# EAGLE board MISSION_FM1 (EAGLE 5.10)
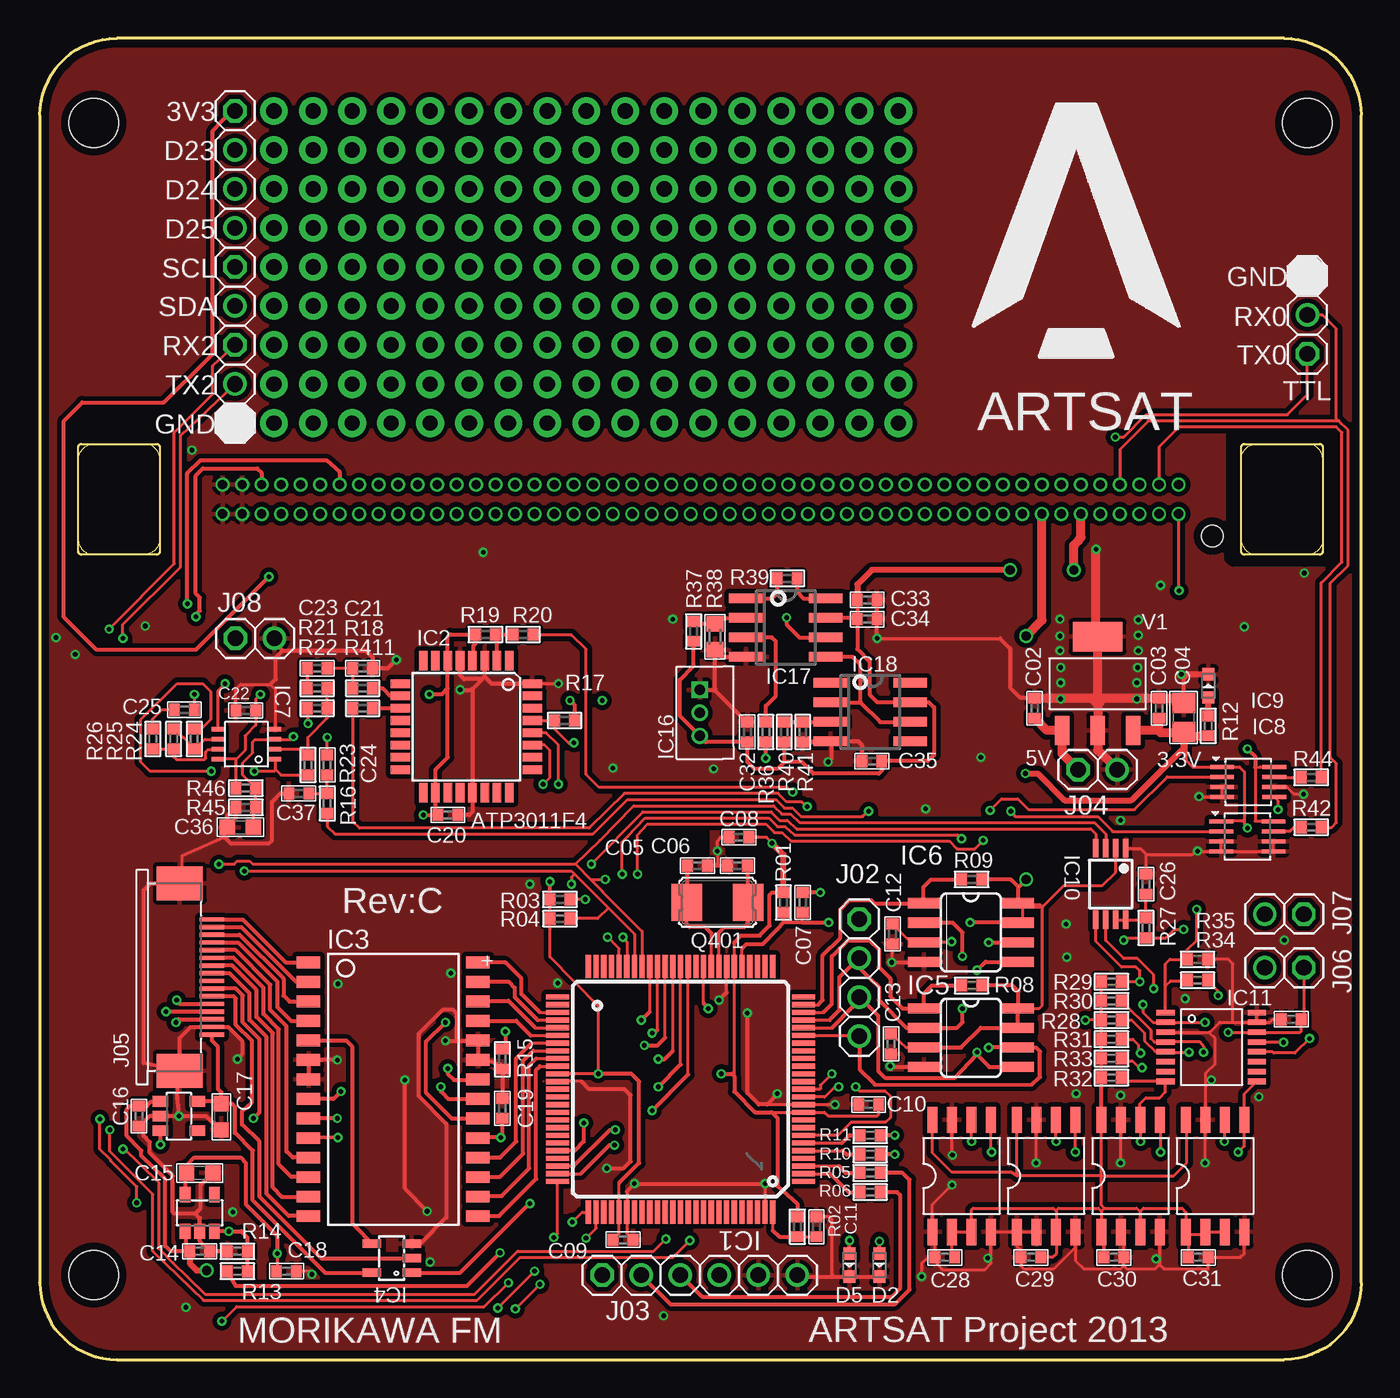
[diagram p2: board, top side]
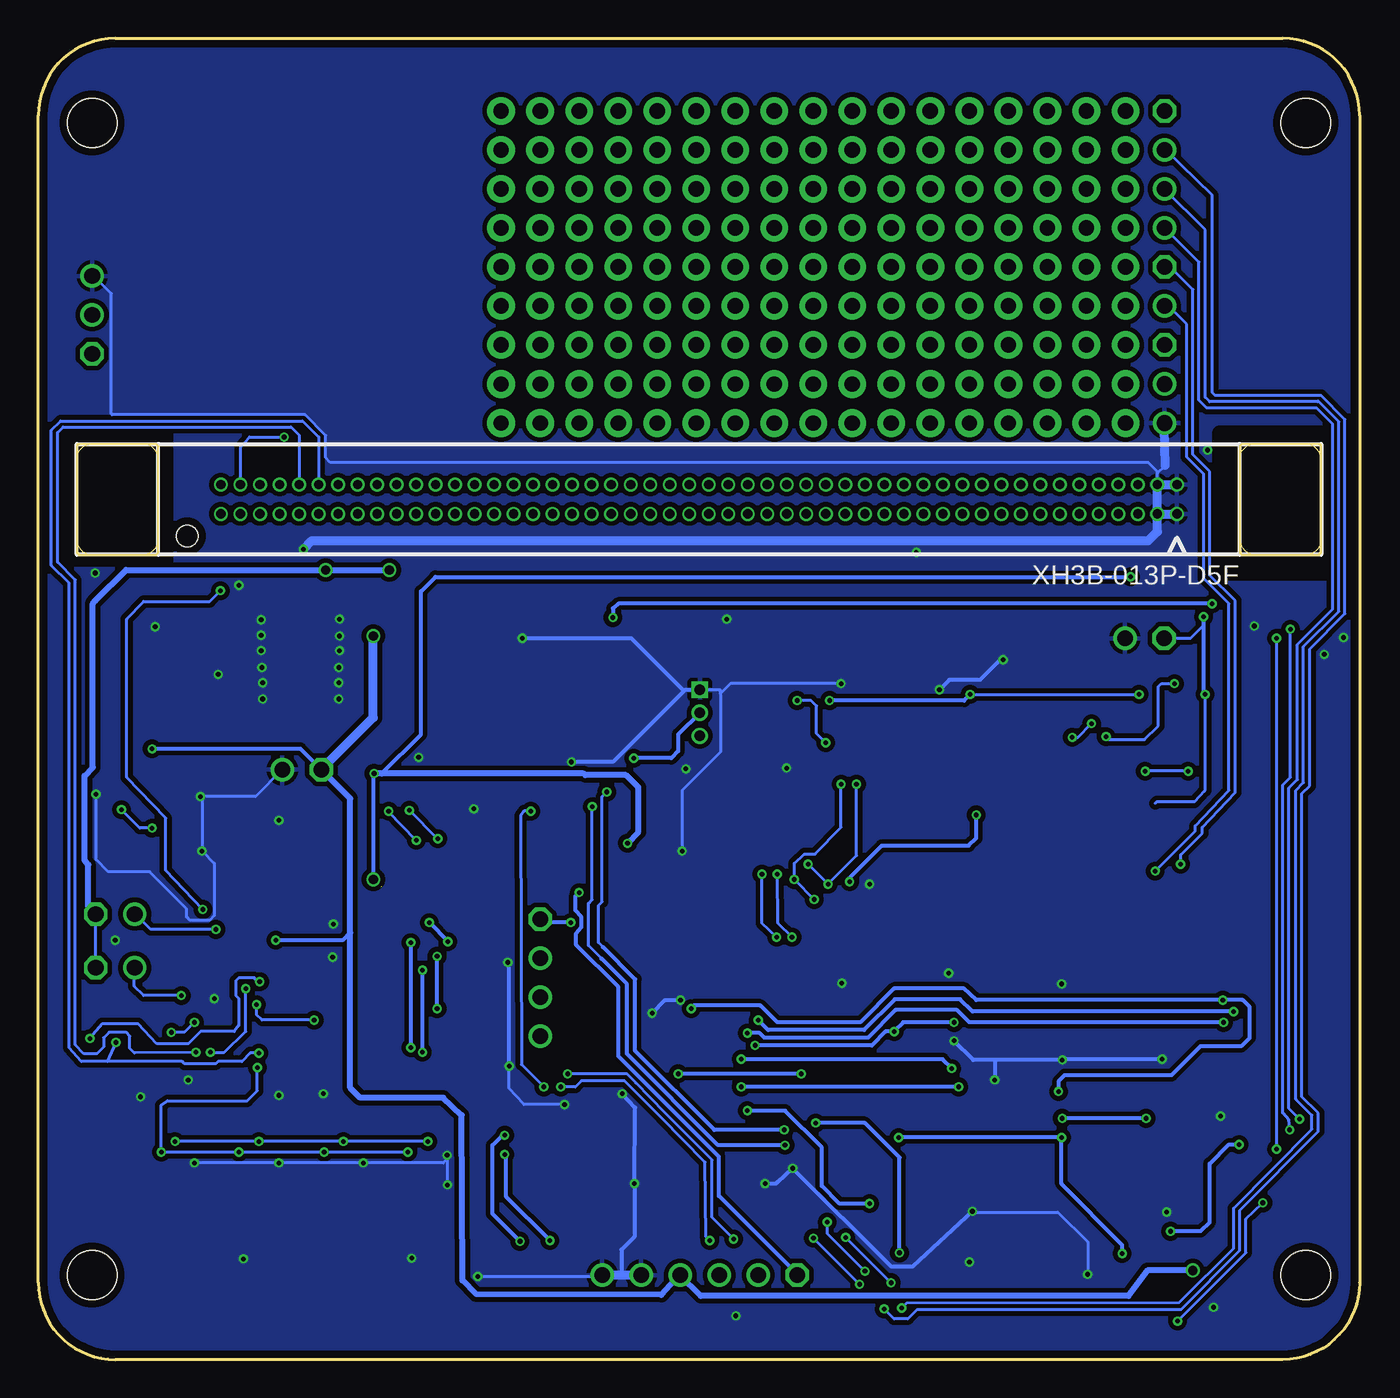
[diagram p3: board, bottom side, seen from below]

Size 86.1 x 86 mm. Coordinates in mm from the lower left corner, seen from the top.
Outline: 0.1,5 0.1,81 arc-90 5.1,86 81.1,86 arc-90 86.1,81 86.1,5 arc-90 81.1,0 5.1,0 arc-90 0.1,5
Outline: 0.1,5 0,5
Outline: 3.7,59.6 6.9,59.6 arc-90 7.9,58.6 7.9,53.4 arc-85 6.9,52.4 3.6,52.4 arc-90 2.6,53.4 2.6,58.6 arc-90 3.7,59.6
Outline: 3.7,59.6 3.6,59.6
Outline: 78.3,53.4 78.3,58.6 arc-90 79.3,59.6 82.6,59.6 arc-90 83.6,58.6 83.6,53.4 arc-90 82.6,52.4 79.3,52.4 arc-90 78.3,53.4
Copper layers (1*16): Top 0.035mm / dielectric 1.53mm / Bottom 0.035mm
Design rules "pban_5mil-l2": minimum track width 5mil, minimum drill 0.3mm, track to track 5mil, track to pad 0.229mm, pad to pad 5mil, via to via 5mil, smd to smd 5mil, copper to edge 0.5mm, drill to drill 0.5mm, minimum pad ring 0.15mm, minimum via ring 0.15mm, stop-mask expansion 4mil, vias tented up to drill 0.35mm, thermal gap 10mil
Holes 3.2 mm at 3.6,5.5 82.6,5.5 3.6,80.5 82.6,80.5
tRestrict: area 45.1,33 to 46.6,33.2; area 46.5,33 to 46.6,33; area 43.3,32.9 to 43.3,34.5; area 43.1,32.9 to 43.3,34.6; 7 lines
bRestrict: area 2.4,51.2 to 9.3,51.2; 10 lines

## Footprints (pad centres in the part's own frame; a part is rotated, then mirrored left to right if it is on the bottom)
C1015(0402) = smd 0.7 x 0.8: 1 -0.65,0; 2 0.65,0
C2012(0805) = smd 1.3 x 1.5: 1 -0.95,0; 2 0.95,0
C1608(0603) = smd 1 x 1: 1 -0.85,0; 2 0.85,0
LED1608 = smd 0.8 x 0.8: A -0.75,0; K 0.75,0
TQFP100 = smd 1.5 x 0.34: 1 -8,6; 2 -8,5.5; 3 -8,5; 4 -8,4.5; 5 -8,4; 6 -8,3.5; 7 -8,3; 8 -8,2.5; 9 -8,2; 10 -8,1.5; 11 -8,1; 12 -8,0.5; 13 -8,0; 14 -8,-0.5; 15 -8,-1; 16 -8,-1.5; 17 -8,-2; 18 -8,-2.5; 19 -8,-3; 20 -8,-3.5; 21 -8,-4; 22 -8,-4.5; 23 -8,-5; 24 -8,-5.5; 25 -8,-6; 51 8,-6; 52 8,-5.5; 53 8,-5; 54 8,-4.5; 55 8,-4; 56 8,-3.5; 57 8,-3; 58 8,-2.5; 59 8,-2; 60 8,-1.5; 61 8,-1; 62 8,-0.5; 63 8,0; 64 8,0.5; 65 8,1; 66 8,1.5; 67 8,2; 68 8,2.5; 69 8,3; 70 8,3.5; 71 8,4; 72 8,4.5; 73 8,5; 74 8,5.5; 75 8,6 | smd 0.34 x 1.5: 26 -6,-8; 27 -5.5,-8; 28 -5,-8; 29 -4.5,-8; 30 -4,-8; 31 -3.5,-8; 32 -3,-8; 33 -2.5,-8; 34 -2,-8; 35 -1.5,-8; 36 -1,-8; 37 -0.5,-8; 38 0,-8; 39 0.5,-8; 40 1,-8; 42 2,-8; 43 2.5,-8; 44 3,-8; 45 3.5,-8; 46 4,-8; 47 4.5,-8; 48 5,-8; 49 5.5,-8; 50 6,-8; 76 6,8; 77 5.5,8; 78 5,8; 79 4.5,8; 80 4,8; 81 3.5,8; 82 3,8; 83 2.5,8; 84 2,8; 85 1.5,8; 86 1,8; 87 0.5,8; 88 0,8; 89 -0.5,8; 90 -1,8; 91 -1.5,8; 92 -2,8; 93 -2.5,8; 95 -3.5,8; 97 -4.5,8; 99 -5.5,8; 100 -6,8 | smd 0.35 x 1.5: 41 1.5,-8 | smd 0.33 x 1.5: 94 -3,8; 96 -4,8; 98 -5,8
TQFP32-08 = smd 1.27 x 0.559: 1 -4.293,2.8; 2 -4.293,2; 3 -4.293,1.2; 4 -4.293,0.4; 5 -4.293,-0.4; 6 -4.293,-1.2; 7 -4.293,-2; 8 -4.293,-2.8; 17 4.293,-2.8; 18 4.293,-2; 19 4.293,-1.2; 20 4.293,-0.4; 21 4.293,0.4; 22 4.293,1.2; 23 4.293,2; 24 4.293,2.8 | smd 0.559 x 1.27: 9 -2.8,-4.293; 10 -2,-4.293; 11 -1.2,-4.293; 12 -0.4,-4.293; 13 0.4,-4.293; 14 1.2,-4.293; 15 2,-4.293; 16 2.8,-4.293; 25 2.8,4.293; 26 2,4.293; 27 1.2,4.293; 28 0.4,4.293; 29 -0.4,4.293; 30 -1.2,4.293; 31 -2,4.293; 32 -2.8,4.293
SOP28 = smd 0.762 x 1.524: 1 -8.255,-5.515; 2 -6.985,-5.515; 3 -5.715,-5.515; 4 -4.445,-5.515; 5 -3.175,-5.515; 6 -1.905,-5.515; 7 -0.635,-5.515; 8 0.635,-5.515; 9 1.905,-5.515; 10 3.175,-5.515; 11 4.445,-5.515; 12 5.715,-5.515; 13 6.985,-5.515; 14 8.255,-5.515; 15 8.255,5.515; 16 6.985,5.515; 17 5.715,5.515; 18 4.445,5.515; 19 3.175,5.515; 20 1.905,5.515; 21 0.635,5.515; 22 -0.635,5.515; 23 -1.905,5.515; 24 -3.175,5.515; 25 -4.445,5.515; 26 -5.715,5.515; 27 -6.985,5.515; 28 -8.255,5.515
SOT23-5@1 = smd 0.55 x 1.2: 1 -0.95,-1.3; 2 0,-1.3; 3 0.95,-1.3; 4 0.95,1.3; 5 -0.95,1.3
SO08 = smd 0.66 x 2.032: 1 -1.905,-3.073; 2 -0.635,-3.073; 3 0.635,-3.073; 4 1.905,-3.073; 5 1.905,3.073; 6 0.635,3.073; 7 -0.635,3.073; 8 -1.905,3.073
TVSP8 = smd 0.3 x 0.8: 1 -0.975,-1.866; 2 -0.325,-1.866; 3 0.325,-1.866; 4 0.975,-1.866; 5 0.975,1.866; 6 0.325,1.866; 7 -0.325,1.866; 8 -0.975,1.866
PSOP8 = smd 0.25 x 1.55: 1 -0.975,-1.7; 2 -0.325,-1.7; 3 0.325,-1.7; 4 0.975,-1.7; 5 0.975,1.7; 6 0.325,1.7; 7 -0.325,1.7; 8 -0.975,1.7
TSSOP8 = smd 1.2 x 0.35: 1 -2.325,0.975; 2 -2.325,0.325; 3 -2.325,-0.325; 4 -2.325,-0.975; 5 2.325,-0.975; 6 2.325,-0.325; 7 2.325,0.325; 8 2.325,0.975
TSSOP16 = smd 0.36 x 1.19: 1 -2.24,-3.03; 2 -1.6,-3.03; 3 -0.96,-3.03; 4 -0.32,-3.03; 5 0.32,-3.03; 6 0.96,-3.03; 7 1.6,-3.03; 8 2.24,-3.03; 9 2.24,2.91; 10 1.6,2.91; 11 0.96,2.91; 12 0.32,2.91; 13 -0.32,2.91; 14 -0.96,2.91; 15 -1.6,2.91; 16 -2.24,2.91
SOIC8 = smd 0.65 x 1.7: 1 -1.9,-3.65; 2 -0.63,-3.65; 3 0.64,-3.65; 4 1.91,-3.65; 5 1.91,3.65; 6 0.64,3.65; 7 -0.63,3.65; 8 -1.9,3.65
LM19_XH = drill 0.7 round: 1 -1.5,0; 2 0,0 | drill 0.7 square: 3 1.5,0
SO8 = smd 0.6 x 2.2: 1 -1.905,-2.6; 2 -0.635,-2.6; 3 0.635,-2.6; 4 1.905,-2.6; 5 1.905,2.6; 6 0.635,2.6; 7 -0.635,2.6; 8 -1.905,2.6
XH3B-013P-D5F = drill 0.6 pad 0.9 round: A1 -31.115,0.953; A2 -29.845,0.953; A3 -28.575,0.953; A4 -27.305,0.953; A5 -26.035,0.953; A6 -24.765,0.953; A7 -23.495,0.953; A8 -22.225,0.953; A9 -20.955,0.953; A10 -19.685,0.953; A11 -18.415,0.953; A12 -17.145,0.953; A13 -15.875,0.953; A14 -14.605,0.953; A15 -13.335,0.953; A16 -12.065,0.953; A17 -10.795,0.953; A18 -9.525,0.953; A19 -8.255,0.953; A20 -6.985,0.953; A21 -5.715,0.953; A22 -4.445,0.953; A23 -3.175,0.953; A24 -1.905,0.953; A25 -0.635,0.953; A26 0.635,0.953; A27 1.905,0.953; A28 3.175,0.953; A29 4.445,0.953; A30 5.715,0.953; A31 6.985,0.953; A32 8.255,0.953; A33 9.525,0.953; A34 10.795,0.953; A35 12.065,0.953; A36 13.335,0.953; A37 14.605,0.953; A38 15.875,0.953; A39 17.145,0.953; A40 18.415,0.953; A41 19.685,0.953; A42 20.955,0.953; A43 22.225,0.953; A44 23.495,0.953; A45 24.765,0.953; A46 26.035,0.953; A47 27.305,0.953; A48 28.575,0.953; A49 29.845,0.953; A50 31.115,0.953; B1 -31.115,-0.953; B2 -29.845,-0.953; B3 -28.575,-0.953; B4 -27.305,-0.953; B5 -26.035,-0.953; B6 -24.765,-0.953; B7 -23.495,-0.953; B8 -22.225,-0.953; B9 -20.955,-0.953; B10 -19.685,-0.953; B11 -18.415,-0.953; B12 -17.145,-0.953; B13 -15.875,-0.953; B14 -14.605,-0.953; B15 -13.335,-0.953; B16 -12.065,-0.953; B17 -10.795,-0.953; B18 -9.525,-0.953; B19 -8.255,-0.953; B20 -6.985,-0.953; B21 -5.715,-0.953; B22 -4.445,-0.953; B23 -3.175,-0.953; B24 -1.905,-0.953; B25 -0.635,-0.953; B26 0.635,-0.953; B27 1.905,-0.953; B28 3.175,-0.953; B29 4.445,-0.953; B30 5.715,-0.953; B31 6.985,-0.953; B32 8.255,-0.953; B33 9.525,-0.953; B34 10.795,-0.953; B35 12.065,-0.953; B36 13.335,-0.953; B37 14.605,-0.953; B38 15.875,-0.953; B39 17.145,-0.953; B40 18.415,-0.953; B41 19.685,-0.953; B42 20.955,-0.953; B43 22.225,-0.953; B44 23.495,-0.953; B45 24.765,-0.953; B46 26.035,-0.953; B47 27.305,-0.953; B48 28.575,-0.953; B49 29.845,-0.953; B50 31.115,-0.953 | hole 1.4: 33.315,2.4
1X04 = drill 1.016 octagon: 1 -3.81,0 | drill 1.016 round: 2 -1.27,0; 3 1.27,0; 4 3.81,0
1X06 = drill 1.016 octagon: 1 -6.35,0 | drill 1.016 round: 2 -3.81,0; 3 -1.27,0; 4 1.27,0; 5 3.81,0; 6 6.35,0
1X02 = drill 1.016 octagon: 1 -1.27,0 | drill 1.016 round: 2 1.27,0
MOREX_527461671 = smd 0.28 x 1.6: 1 -3.75,0; 2 -3.25,0; 3 -2.75,0; 4 -2.25,0; 5 -1.75,0; 6 -1.25,0; 7 -0.75,0; 8 -0.25,0; 9 0.25,0; 10 0.75,0; 11 1.25,0; 12 1.75,0; 13 2.25,0; 14 2.75,0; 15 3.25,0; 16 3.75,0 | smd 2.2 x 3: P1 -6.1,2.1; P2 6.1,2.1
1X03 = drill 1.016 octagon: 1 -2.54,0 | drill 1.016 round: 2 0,0; 3 2.54,0
NX5032GA = smd 2 x 2.4: 1 -2,0; 2 2,0
R1005M(0603) = smd 0.7 x 0.8: 1 -0.65,0; 2 0.65,0
R1608M(0603) = smd 1 x 1.1: 1 -0.85,0; 2 0.85,0
SOT-223 = smd 0.95 x 1.9: 1 -2.3,-3.05; 2 0,-3.05; 3 2.3,-3.05 | smd 3.25 x 1.9: 4 0,3.05
SOT-25 = smd 0.7 x 1: 1 -0.95,-1.2; 2 0,-1.2; 3 0.95,-1.2; 4 0.95,1.2; 5 -0.95,1.2

## Placement (x,y rotation side)
C02  0.1u  [C1015(0402)]  64.85,42.4 90 top
C03  0.1u  [C1015(0402)]  72.95,42.4 90 top
C04  10u  [C2012(0805)]  74.55,41.8 90 top
C05  15p  [C1015(0402)]  42.9,32.15 180 top
C06  15p  [C1015(0402)]  45.5,32.15 0 top
C07  0.1u  [C1015(0402)]  49.75,29.75 270 top
C08  0.1u  [C1015(0402)]  45.6,34 180 top
C09  0.1u  [C1015(0402)]  38.05,7.8 0 top
C10  0.1u  [C1015(0402)]  54.05,16.6 180 top
C11  0.1u  [C1015(0402)]  50.65,8.65 90 top
C12  0.1u  [C1015(0402)]  55.6,27.7 270 top
C13  0.1u  [C1015(0402)]  55.5,20.55 270 top
C14  0.1u  [C1015(0402)]  10.5,7.05 0 top
C15  10uF  [C1608(0603)]  10.5,12.15 0 top
C16  0.1u  [C1015(0402)]  6.55,15.85 270 top
C17  10uF  [C1608(0603)]  11.9,15.8 270 top
C18  0.1u  [C1015(0402)]  16.15,5.75 0 top
C19  0.1u  [C1015(0402)]  30.2,16.35 90 top
C20  0.1u  [C1015(0402)]  26.65,35.45 0 top
C21  4.7u  [C1015(0402)]  21.1,45 0 top
C22  0.1u  [C1015(0402)]  13.5,42.25 180 top
C23  0.1u  [C1015(0402)]  18.15,45 180 top
C24  0.1u  [C1015(0402)]  18.8,38.7 90 top
C25  0.1u  [C1015(0402)]  9.5,42.3 180 top
C26  0.1u  [C1015(0402)]  72.1,30.95 90 top
C27  0.1u  [C1015(0402)]  81.55,22.15 180 top
C28  0.1u  [C1015(0402)]  59,6.65 180 top
C29  0.1u  [C1015(0402)]  64.6,6.65 180 top
C30  0.1u  [C1015(0402)]  70,6.65 0 top
C31  0.1u  [C1015(0402)]  75.5,6.65 0 top
C32  0.1u  [C1015(0402)]  46.15,40.85 90 top
C33  0.1u  [C1015(0402)]  53.95,49.45 0 top
C34  0.1u  [C1015(0402)]  53.95,48.2 0 top
C35  0.1u  [C1015(0402)]  54.25,38.95 180 top
C36  10uF  [C1608(0603)]  13.15,34.65 180 top
C37  4.7u  [C1015(0402)]  16.95,36.85 180 top
D1  LED1608  [LED1608]  52.8,6.15 270 top
D2  LED1608  [LED1608]  54.75,6.15 270 top
D401  LED1608  [LED1608]  76.15,43.85 90 top
IC1  ATMEGA2560  [TQFP100]  41.8,17.6 180 top
IC2  APT3011F4-AU  [TQFP32-08]  27.85,41.2 270 top
IC3  AL422B  [SOP28]  23.1,17.6 270 top
IC4  SN74LVC1G00DVBR  [SOT23-5@1]  23,6.6 90 top
IC5  FM25V10  [SO08]  60.7,20.95 270 top
IC6  M25P80  [SO08]  60.7,27.8 270 top
IC7  NJM8202  [TVSP8]  13.55,40.05 90 top
IC8  SN74LVC2T45  [PSOP8]  78.7,34.05 270 top
IC9  SN74LVC2T45  [PSOP8]  78.75,37.6 270 top
IC10  PCA9306DP1  [TSSOP8]  69.8,30.95 270 top
IC11  ADG709  [TSSOP16]  76.4,20.35 270 top
IC12  24LC1025-I/SM  [SOIC8]  65.6,11.95 0 top
IC13  24LC1025-I/SM  [SOIC8]  71.1,11.95 0 top
IC14  24LC1025-I/SM  [SOIC8]  76.6,11.95 0 top
IC15  24LC1025-I/SM  [SOIC8]  60.1,11.95 0 top
IC16  LM19_ZH  [LM19_XH]  43.05,42.1 90 top
IC17  AD623R  [SO8]  48.65,47.65 270 top
IC18  AD8541R  [SO8]  54.15,42.15 270 top
J01  XH3B-013P-D5F_NEW  [XH3B-013P-D5F]  43.1,56 180 bottom
J02  [1X04]  53.44,24.86 270 top
J03  [1X06]  43.05,5.5 0 top
J04  [1X02]  68.95,38.4 0 top
J05  FFCMOREX_527461671  [MOREX_527461671]  11.3,24.9 90 top
J06  [1X02]  81.1,25.5 180 top
J07  [1X02]  81.1,29 180 top
J08  [1X02]  14.1,46.95 0 top
J09  [1X03]  82.6,68 90 top
J10  [1X04]  12.8,77.47 270 top
J11  [1X02]  12.8,69.85 270 top
J12  [1X03]  12.8,63.5 270 top
Q401  NX5032GA  [NX5032GA]  44.2,29.75 180 top
R01  10k  [R1005M(0603)]  48.5,29.75 90 top
R02  0  [R1005M(0603)]  49.4,8.65 270 top
R03  4.7k  [R1005M(0603)]  33.95,29.95 180 top
R04  4.7k  [R1005M(0603)]  33.95,28.7 180 top
R05  100  [R1005M(0603)]  54.15,12.15 180 top
R06  100  [R1005M(0603)]  54.15,10.9 180 top
R08  100k  [R1005M(0603)]  60.75,24.35 0 top
R09  100k  [R1005M(0603)]  60.75,31.25 0 top
R10  10k  [R1005M(0603)]  54.15,13.35 180 top
R11  10k  [R1005M(0603)]  54.15,14.6 180 top
R12  1k  [R1005M(0603)]  76.15,41.25 90 top
R13  1k  [R1005M(0603)]  12.95,5.75 0 top
R14  10k  [R1005M(0603)]  12.95,7.05 0 top
R15  1k  [R1005M(0603)]  30.2,19.55 90 top
R16  4.7k  [R1005M(0603)]  18.8,36.2 90 top
R17  10k  [R1005M(0603)]  34.25,41.6 180 top
R18  4.7k  [R1005M(0603)]  21.1,43.7 180 top
R19  10k  [R1005M(0603)]  29.1,47.2 180 top
R20  1k  [R1005M(0603)]  31.55,47.2 180 top
R21  6.8k  [R1005M(0603)]  18.15,43.7 0 top
R22  20k  [R1005M(0603)]  18.15,42.4 0 top
R23  20k  [R1005M(0603)]  17.55,38.7 270 top
R24  20k  [R1005M(0603)]  10.15,40.4 270 top
R25  200k  [R1005M(0603)]  8.8,40.4 270 top
R26  51  [R1005M(0603)]  7.45,40.4 90 top
R27  200k  [R1005M(0603)]  72.1,28.1 270 top
R28  2k  [R1005M(0603)]  69.85,22.1 180 top
R29  2k  [R1005M(0603)]  69.85,24.6 180 top
R30  2k  [R1005M(0603)]  69.85,23.35 180 top
R31  2k  [R1005M(0603)]  69.85,20.85 180 top
R32  2k  [R1005M(0603)]  69.85,18.35 180 top
R33  2k  [R1005M(0603)]  69.85,19.6 180 top
R34  1k  [R1005M(0603)]  75.45,24.7 0 top
R35  10k  [R1005M(0603)]  75.45,26.05 180 top
R36  820  [R1005M(0603)]  47.35,40.85 90 top
R37  2k  [R1005M(0603)]  42.65,47.4 90 top
R38  1k  [R1608M(0603)]  44.05,47.05 90 top
R39  33k  [R1005M(0603)]  48.75,50.85 180 top
R40  10k  [R1005M(0603)]  48.55,40.85 270 top
R41  10k  [R1005M(0603)]  49.75,40.85 90 top
R42  100  [R1005M(0603)]  82.85,34.65 180 top
R44  100  [R1005M(0603)]  82.85,37.9 0 top
R45  4.7k  [R1005M(0603)]  13.5,35.95 0 top
R46  4.7k  [R1005M(0603)]  13.5,37.2 180 top
R411  1k  [R1005M(0603)]  21.1,42.4 0 top
U$1  [ARTSAT_LOGO_16MM]  60.1,64 0 top
V1  TC1262-VDB  [SOT-223]  68.95,44 0 top
V2  XC6209F332MR  [SOT-25]  10.5,9.55 0 top
V3  XC6221A282MR  [SOT-25]  9.15,15.85 270 top

## Tracks (layer width: path | path; a pad name or v marks a point on that pad's centre or on a via)
AOUT  (via drill 0.3)
  Top 0.2: 10.2,42.25 C25.1 10.2,42.35 10.1,42.45 10.15,42.45 v10.15,43.3
  Top 0.25: J01.B3 14.53,57.73 14.25,58 10.7,58 10.25,57.55 10.25,49.85 10.5,49.6 10.5,48.75 10.25,48.5 v10.25,48.35 | v10.15,43.3 10.25,43.4
  Bottom 0.2: 13.4,36.2 13.3,36.3 10.85,36.3 10.2,37 10.15,37.05 v10.15,43.3 | J08.1 11.1,46.95 10.25,47.8
  Bottom 0.25: v10.25,48.35 10.25,47.8 10.25,43.4 v10.15,43.3
BBBB
  Top 0.25: R05.1 56.25,12.15 56.7,11.7 56.7,4.55 55.75,3.6 41.14,3.6 J03.2
BBBBB
  Top 0.25: J03.3 41.8,5.5 43.2,4.1 55.55,4.1 56.1,4.65 56.1,10.7 55.9,10.9 R06.1
BUS_SCL  (via drill 0.3)
  Top 0.2: 70.7,23.35 R30.1 72.4,21.45 72.4,20.9 72.63,20.67 IC11.4 73.35,20.7 75.6,20.7 75.85,20.4 v75.85,20
  Bottom 0.2: v75.85,20 79.85,19.95 80.15,20.25 80.15,21.05 80.4,21.3 81.5,21.3 81.85,20.95 81.85,20.35 82.3,19.9 83.15,19.9 83.7,20.5 83.7,50.75 84.85,51.9 84.85,60.35 84.5,60.7 69.65,60.7 69.13,60.19 J01.B46
BUS_SDA  (via drill 0.3)
  Top 0.2: R31.1 71.25,20.85 71.6,20.5 71.6,20.1 v71.75,19.95 | v81.05,20.65 79.33,20.65 IC11.13
  Bottom 0.2: v71.75,19.95 72.3,19.95 72.85,19.4 74.4,19.4 74.55,19.25 76.6,19.25 76.75,19.4 81.6,19.4 | 81.6,19.4 83.3,19.4 84.1,20.3 84.1,50.55 85.25,51.7 85.25,60.5 84.65,61.1 68.9,61.1 67.85,60.05 67.85,56.97 J01.B45 | 81.6,19.4 v81.05,20.65
C4022
  Top 0.2: IC1.33 44.3,27.8
  Top 0.25: 44.3,27.8 44.65,28.15 45.95,28.15 46.15,28.35 46.15,28.4 46.2,28.45 Q401.1 46.2,32.1 C06.2
CAM_PWR  (via drill 0.3)
  Top 0.2: 34.9,13.6 IC1.71
  Top 0.25: 34.9,13.6 35.5,14.2 v35.5,15.4 | v30.05,6.95 27.9,4.8 12.85,4.8 R13.1
  Bottom 0.25: v35.5,15.4 32.3,15.4 30.05,13.15 v30.05,6.95
D0
  Top 0.25: IC3.1 16.09,25.86 13.3,28.65 J05.16
D1
  Top 0.25: J05.15 13.2,28.15 16.75,24.6 17.47,24.6 IC3.2
D2
  Top 0.25: J05.14 13.1,27.65 15.95,24.8 15.95,23.7 16.35,23.3 17.47,23.3 IC3.3
D3
  Top 0.25: IC3.4 16.46,22.05 15.55,22.95 15.55,24.6 13,27.15 J05.13
D4
  Top 0.25: J05.12 12.85,26.65 15.1,24.4 15.1,22.75 16.15,21.7 16.15,13.55 16.55,13.15 17.48,13.15 IC3.11
D5
  Top 0.25: IC3.12 16.46,11.88 15.65,12.7 15.65,21.5 14.65,22.5 14.65,24.2 12.7,26.15 J05.11
D6
  Top 0.25: J05.10 12.6,25.65 14.2,24.05 14.2,22.3 15.25,21.25 15.25,11.2 15.85,10.6 17.47,10.6 IC3.13
D7
  Top 0.25: J05.9 12.45,25.15 13.75,23.85 13.75,22.1 14.85,21 14.85,10.8 16.3,9.35 17.48,9.35 IC3.14
D23  (via drill 0.3)
  Top 0.2: v31.05,3.3 v32.65,4.9 | v35.65,7.9 36.3,8.55 IC1.77
  Bottom 0.2: J10.2 12.74,78.74 9.7,75.8 9.7,62.95 9.5,62.75 2.6,62.75 1.05,61.2 1.05,48.55 3.35,46.25 3.35,37.35 3.85,36.85 3.85,17.1 2.8,16.05 2.8,14.85 7.9,9.7 7.9,7.1 11.75,3.25 28.9,3.25 29.5,2.65 30.4,2.65 v31.05,3.3 | v32.65,4.9 v35.65,7.9
D24  (via drill 0.3)
  Top 0.2: IC1.76 35.4,9.6 v34.75,8.95 | v29.9,3.35 v32.3,5.75
  Bottom 0.2: v34.75,8.95 34.75,8.2 v32.3,5.75 | v29.9,3.35 29.6,3.65 11.85,3.7 8.3,7.25 8.3,9.85 3.2,15 3.2,15.9 4.25,16.95 4.25,37.05 3.75,37.55 3.75,46.4 1.45,48.7 1.45,61.05 2.8,62.4 2.85,62.35 9.85,62.35 10.15,62.65 10.15,73.54 J10.3
D25  (via drill 0.3)
  Top 0.2: IC1.75 33.8,8.2 v33.55,7.95 | v30.6,5 29,3.45 12.9,3.45 v11.95,2.5 | v4,15.65 4,13.7 4.7,13 4.75,12.9 6.4,11.25 v6.4,10.2
  Bottom 0.2: v30.6,5 v33.55,7.95 | v4,15.65 4.7,16.35 4.7,37.2 4.15,37.75 4.15,46.55 1.85,48.85 1.85,60.9 2.9,61.95 10.05,61.95 10.55,62.45 10.55,71.44 12.77,73.66 J10.4 | v11.95,2.5 7.5,6.95 7.5,9.15 v6.4,10.2
DIGI_OUT
  Top 0.2: C23.1 C21.1 R18.2
DIGI_PLAY  (via drill 0.3)
  Top 0.2: IC1.74 35.3,12.1 | R411.1 20.5,42.35 20.5,35 20.9,34.6 35.85,34.6 38.15,36.85 48.15,36.85 48.7,36.3 49.7,36.3 v50.05,36
  Top 0.25: 35.3,12.1 37.15,13.95 v37.5,13.95
  Bottom 0.2: 47.8,24.45 50.3,26.95 50.3,29.7 50.05,29.95 v50.05,36
  Bottom 0.25: v37.5,13.95 41.85,13.95 47.8,19.9 47.8,24.45 49.45,26.1
DIGI_SLEEP  (via drill 0.3)
  Top 0.2: IC1.73 34.85,12.6 | R20.1 32.25,47.15 34.7,47.15 35.65,46.25 35.65,38.1 36.5,37.25 48.75,37.25 v49.1,36.95
  Top 0.25: 34.85,12.6 37.2,14.95 v37.55,14.95
  Bottom 0.2: 49.35,26.85 49.65,27.15 49.65,29.55 49.4,29.8 49.4,36.65 v49.1,36.95
  Bottom 0.25: v37.55,14.95 42.1,14.95 47.25,20.1 47.25,24.75 49.35,26.85
DO0
  Top 0.2: 32.65,22.6 IC1.53
  Top 0.25: 32.65,22.6 31.45,23.8 31.45,24.8 30.4,25.85 IC3.28
DO1
  Top 0.2: 32.5,22.1 IC1.54
  Top 0.25: 32.5,22.1 31,23.6 31,24.2 30.6,24.6 IC3.27
DO2
  Top 0.2: 32.35,21.6 IC1.55
  Top 0.25: 32.35,21.6 30.6,23.35 28.65,23.35 IC3.26
DO3
  Top 0.2: 32.05,21.1 IC1.56
  Top 0.25: 32.05,21.1 31.1,22.05 IC3.25
DO4
  Top 0.2: 32.1,20.6 IC1.57
  Top 0.25: IC3.18 30.05,13.15 31.1,14.2 31.1,19.6 32.1,20.6
DO5
  Top 0.2: 32.2,20.1 IC1.58
  Top 0.25: 32.2,20.1 31.55,19.45 31.55,13.4 30.05,11.9 IC3.17
DO6
  Top 0.2: 32.4,19.6 IC1.59
  Top 0.25: 32.4,19.6 31.95,19.15 31.95,12.45 30.15,10.65 28.65,10.65 IC3.16
DO7
  Top 0.2: 32.65,19.1 IC1.60
  Top 0.25: IC3.15 30,9.35 32.4,11.75 32.4,18.85 32.65,19.1
F  (via drill 0.3)
  Top 0.2: R28.1 71.15,22.1 72,21.25 72,20.75 72.7,20.05 73.35,20.05 IC11.5 73.4,20 v74.9,20 | IC10.6 69.47,27.27 70.65,26.1 71.55,26.1 72.6,25.05 v72.6,24.15
  Bottom 0.2: v72.6,24.15 72.6,21.35 74,20 v74.9,20
FLASH_CS
  Top 0.2: IC1.24 50.75,23.1
  Top 0.25: 50.75,23.1 51.05,23.4 51.05,26.3 52.2,27.45 52.2,29.3 52.8,29.91 54.2,29.91 54.4,29.7 IC6.1 57.6,29.73 57.6,30.75 58.1,31.25 R09.1
FRAM_CS
  Top 0.2: IC1.23 51.1,22.6
  Top 0.25: 51.1,22.6 51.65,23.15 51.65,26.25 52.7,27.3 54.1,27.3 54.7,26.7 54.7,25.55 55.45,24.8 55.45,23.65 56.25,22.85 56.5,22.86 IC5.1 57.65,22.88 57.65,23.85 58.15,24.35 R08.1
GND  (via drill 0.3)
  Top 0.2: 38.3,10.95 IC1.81 38.3,8.2 C09.2 | v47.3,11.45 IC1.99 | 44.8,23.9 IC1.32 | 47.45,16.6 IC1.11 v51.85,16.6 | 35.35,18.1 IC1.62 | IC11.15 IC11.16 | IC11.15 80.15,21.95 80.35,22.15 C27.2 | IC11.3 76.26,21.31 76.9,21.95 77.75,21.95 | 77.75,21.95 IC11.15 | IC12.1 63.7,7.35 63.95,7.1 C29.2 63.95,6.1 64.15,5.9 66.1,5.9 67.51,7.31 IC12.4 67.51,6.44 68.05,5.9 70.45,5.9 70.65,6.1 | IC13.2 70.65,8.12 C30.2 70.65,6.1 | IC14.4 78.5,6.9 78.25,6.65 C31.2 76.15,5.9 73.25,5.9 73,6.15 IC13.4 73.01,6.21 72.7,5.9 70.85,5.9 70.65,6.1 | IC12.1 IC15.4 62.01,6.26 61.6,5.85 58.85,5.85 58.25,6.6 | IC12.1 IC12.2 | 58.25,6.6 C28.2 58.35,8.15 IC15.1 58.2,10.1 v59.47,11.37 | 58.25,6.6 58,6.7 57.5,6.25 v57.5,5.4 | IC15.7 59.47,13.33 v59.5,13.3 | v75.95,12.8 75.95,15.58 IC14.7 75.97,15.73 76,15.75 76,18.65 76.6,19.25 76.6,20.9 | 76.6,20.9 76.45,21.06 | 76.6,20.9 76.2,21.31 | IC13.7 70.47,12.82 v70.45,12.8 | IC5.4 56.84,19.05 | R35.1 77.45,26.05 77.75,25.75 77.75,21.95 | 72.1,32.9 C26.2 | 72.1,32.9 71.75,33.25 70.8,33.25 IC10.1 | IC7.4 15.42,43.63 15.1,43.95 13.15,43.95 12.85,43.65 C22.2 | 44.05,32.15 44.2,32.3 v44.2,33.1 44.2,33.75 44.4,34 C08.2 | v54.6,46.95 62.6,46.95 | 31.4,44 v33.85,44 | IC8.4 IC8.5 IC8.6 | v75.55,36.65 75.57,36.62 | 75.57,36.62 IC9.4 IC9.3 | 75.57,36.62 75.55,36.6 | IC8.4 75.47,33.08 v75.45,33.1 75.35,33.1 75.1,32.85 72.15,32.85 72.1,32.9 | 12.08,34.03 9.35,32.8 9.35,31.25 9.3,31.25 9.3,31.1 J05.P2 | C11.2 51.5,9.3 51.65,9.15 51.65,5.55 51.8,5.4 | v55.45,19.1 55.45,19.75 C13.2 | C12.2 55.6,25.9 v55.55,25.85 | IC4.3 24.25,7.5 | C18.2 17.6,5.75 v17.8,5.55 | IC8.4 IC8.3 | IC9.6 81.27,37.27 81.75,36.8 v82.35,36.8
  Top 0.2: v64.95,12.8 64.95,15.58 IC12.7 64.97,12.82 v64.95,12.8
  Top 0.25: C35.2 53.6,40 53.35,40.25 IC18.4 51.55,40.2 R41.1 51.6,40.2 51.65,40.15 51.65,39.15 v51.4,38.9 | C33.2 C34.2 v54.6,46.95 | C32.2 46.1,41.5 44,43.6 | IC16.3 44,43.6 | IC17.4 44.51,45.74 R38.1 44.05,43.65 44,43.6 | C06.1 44.05,32.15 C05.1 | 38.3,10.95 v38.8,11.45 v47.3,11.45 | v44.3,23.4 44.8,23.9 | v46.15,22.55 46.15,17.35 46.9,16.6 47.45,16.6 v48.1,17.3 | 35.35,18.1 35.85,17.6 38.15,17.6 38.55,17.2 38.55,12.9 38.1,12.45 v37,12.45 | v55.45,19.1 55.6,19.05 55.61,19.05 IC5.4 | v55.55,25.85 57.58,25.85 IC6.4 | C19.2 R15.1 30.1,19.2 29.15,19.5 IC3.23 IC3.24 28.59,20.75 27.3,20.75 | IC3.7 IC3.6 18.46,19.5 v19.45,19.5 | v26.5,20.75 27.3,20.75 | IC4.3 24.85,7.55 26.55,9.25 26.55,15.35 24.75,17.15 24.75,21.2 26.3,22.75 27,22.75 27.25,22.5 27.25,20.8 27.3,20.75 | J05.P2 7.3,31 6.85,30.55 6.85,19.3 9.1,18.75 9.1,18.7 | 9.1,18.7 J05.P1 9.2,20.95 9.9,21.65 J05.2 12.35,21.65 13.25,20.75 13.25,19.85 v12.95,19.55 | 9.3,15.85 V3.2 7.25,15.85 6.6,15.2 C16.2 6.85,14.9 6.85,14.55 7.25,14.15 7.25,13.45 8.75,11.95 8.75,9.6 8.85,9.5 10.2,9.5 | 9.3,15.85 10.9,15.85 11.3,15.45 11.4,15.45 C17.2 | 10.2,9.5 10.5,9.2 V2.2 10.5,7.7 C14.2 R14.1 | 10.2,9.5 10.55,9.85 10.55,11.35 10.8,11.6 11.15,11.9 C15.2 | 9.1,18.7 9.05,17.05 9.1,16.55 9.15,16 9.3,15.85 | v23.85,18.2 23.85,11.15 v25.3,9.65 | 74.85,44.6 74.55,44.3 C04.2 | 51.8,5.4 49.95,5.4 49.45,5.5 J03.6 | 29.05,44.45 IC2.3 | 28.9,44.3 29.05,44.45 | 28.9,44.3 27.7,44.3 27.45,44.55 IC2.5 | C20.2 28.05,35.45 28.25,35.65 IC2.21 28.25,43.65 | 28.25,43.65 28.9,44.3 | IC2.32 31.4,44 29.5,44 29.05,44.45 | v23.3,45.55 22.75,45 C21.2 21.75,45.7 21.3,46.15 15.9,46.15
  Top 0.25: v27.45,43.6 28.2,43.6 28.25,43.65 | 15.9,46.15 15.45,45.7 15.45,44.3 15.1,43.95 | 62.6,46.95 63.25,46.3 63.25,43.75 63.9,43.1 64.8,43.1 C02.2 | J08.2 15.37,46.68 15.9,46.15 | R45.1 12.3,35.4 C36.2 12.08,34.43 12.08,34.03 12.51,33.6 15,33.6 15.2,33.8 15.2,36.3 15.75,36.85 C37.2
  Top 0.254: 51.8,5.4 D1.K D2.K
  Top 0.406: D401.K v74.4,44.6
  Top 0.6: 68.95,42.65 68.55,43.05 C02.2 | 68.95,42.65 V1.4 68.85,47.15 v68.85,52.75 | 68.95,42.65 V1.2 68.95,39.67 J04.2 | 68.95,42.65 69.35,43.05 C03.2 74.2,43.05 C04.2
  Bottom 0.2: v57.5,5.4 49.5,5.4 J03.6 | v59.47,11.37 59.47,13.27 v59.5,13.3 59.5,13.05 59.75,12.8 v64.95,12.8 v70.45,12.8 v75.95,12.8 | v51.85,16.6 54.5,16.6 55.45,17.65 v55.45,19.1 | 41.7,43.35 41.7,39.55 44.2,37.05 v44.2,33.1 | IC16.3 41.7,43.6 41.7,43.35 | 41.7,43.35 41.05,44 v33.85,44 | J04.2 71.97,36.65 v75.55,36.65 75.45,36.55 v75.45,33.1 74.65,32.3 74.65,28.9 74.95,28.6 76.25,28.6 76.45,28.8 76.45,29.35 78.85,31.75 81.55,31.75 82.35,32.55 v82.35,36.8 | v17.8,5.55 17.8,7.65 19.75,9.6 25.25,9.6 v25.3,9.65 | J09.3 82.49,70.54 81.35,69.4 81.35,61.55 81.3,61.5 68.75,61.5 67.4,60.15 67.4,58.7 67.1,58.4 13.85,58.4 13.25,57.8 13.25,57.7 | 13.25,57.7 J01.B2 | 12.8,60.65 12.78,60.77 J12.3 | 13.25,57.7 12.75,58.2
  Bottom 0.25: v51.4,38.9 48.7,38.9 44.08,43.52 | 44.08,43.52 44,43.6 IC16.3 | v54.6,46.95 47.5,46.95 44.08,43.52 | v44.3,23.4 45.3,23.4 v46.15,22.55 | v48.1,17.3 47.25,16.4 v47.3,11.45 47.3,8 48.15,7.15 48.15,5.7 47.95,5.5 J03.5 | 37.06,12.41 38,11.55 38.1,11.45 v38.8,11.45 | 37.06,12.41 v37,12.45 | v55.45,19.1 55.45,25.7 v55.55,25.85 | 23.85,19.5 v19.45,19.5 19.2,19.55 v12.95,19.55 | 23.85,19.5 25.25,19.5 v26.5,20.75 | v25.3,9.65 29.2,6.05 30.57,6.05 37.03,12.46 37.02,12.46 | 37.02,12.46 | 37.02,12.46 37.06,12.41 | 23.85,19.5 v23.85,18.2 | v23.3,45.55 23.5,45.55 24.8,44.25 26.8,44.25 v27.45,43.6
  Bottom 0.6: J03.5 J03.6 | J01.B1 J01.B2 J01.A2 | J01.A2 J01.A1 | J01.A2 13.25,53.9 13.85,53.3 68.3,53.3 v68.85,52.75 | 12.75,58.2 12.8,60.65
  other vias: 19.5,24.45 32,30.95 33.8,24.5 26.85,25.15 25.5,6.35 9.15,15.85 12.65,9.6 57.75,35.85 70.45,35.1 66.9,28.35 66.95,26.2 67.55,17.3 76.35,18.2 74.65,23.5 81.1,27.3 72.75,6.55 61.8,6.6 40.7,2.85 9.6,3.4 1.15,47 2.4,45.9 6.95,47.75 28.95,52.55 43.95,38.45 37.4,38.5 41.3,48.2 61.35,39.2 78.5,47.7 71.6,46.15 71.6,47.15 71.6,48.15 66.5,48.2 66.5,47.1 66.5,46.15 66.55,45.05 66.55,44.05 66.55,43 71.55,45.05 71.5,44.05 71.5,43 82.4,51.2 73.05,50.4 10,59.2 79.45,17.1 70.45,17.2
  pour Bottom (isolate 0.305): 5.1,86 arc90 0.1,81 0.1,4.5 arc90 5.6,0 81.1,0 arc90 86.1,5 86.1,80.5 arc90 81.6,86
  pour Top (isolate 0.305): 5.1,86 arc90 0.1,81 0.1,5 arc90 5.1,0 81.1,0 arc90 86.1,5 86.1,80.3 arc90 81.6,86
HREF
  Top 0.25: J05.6 12.7,23.65 12.85,23.5 12.85,21.8 13.9,20.75 13.9,16.75 13.25,16.15 13.25,15.3 14.4,14.2 14.4,10.6 18.4,6.6 IC4.2
LED2
  Top 0.2: IC1.5 52.35,13.6
  Top 0.25: R10.2 52.6,13.35 52.35,13.6
LED3
  Top 0.2: IC1.6 52.3,14.1
  Top 0.25: 52.3,14.1 52.8,14.6 R11.2
MAIN_VDD5  (via drill 0.3, 0.6)
  Top 0.2: R29.2 R30.2 R28.2 | R28.2 R31.2 R33.2 R32.2 | C28.1 59.47,6.83 IC15.2 IC15.3 60.74,9.74 60.85,9.85 66.05,9.85 66.25,9.7 | 74.85,8.15 C31.1 | 74.85,8.15 IC14.1 74.7,9.6 74.45,9.85 71.95,9.85 71.74,9.64 IC13.3 71.74,9.61 71.5,9.85 69.4,9.85 | 74.85,8.15 75.82,8.15 IC14.2 IC14.3 | 69.2,9.65 69.4,9.85 | 69.2,8.9 IC13.1 69.35,8.15 C30.1 69.35,8.75 69.2,8.9 | 69.2,9.65 69.2,8.9 | 69.2,9.65 69,9.85 66.4,9.85 66.25,9.7 | 66.25,9.7 IC12.3 66.25,6.9 66,6.65 C29.1 | 69.2,11.95 69.2,10.05 69.4,9.85 | 63.7,11.95 IC12.8 | 63.7,11.95 63.35,12.2 59.45,12.2 58.2,13.45 IC15.8 | 69.2,11.95 63.7,11.95 | 69.2,11.95 IC13.8 | 69.2,11.95 73.9,11.95 74.75,12.8 74.75,15.55 IC14.8 | J06.1 82.4,25.47 82.4,21.9 C27.1 82.2,21.35 82.15,21.3 IC11.14 v77.46,21.31 v77.45,21.3 | v75.95,21.95 IC11.2 72.55,21.95 71.9,22.6 v71.9,23.1 | R28.2 v68.15,22.1
  Top 0.25: IC17.7 53.22,48.28 C34.1 | C33.1 C34.1 | R37.1 42.65,45.15 41.75,44.25 41.75,41.9 IC16.1 43.45,40.2 C32.1 46.15,38.9 46.6,38.45 48.1,38.45 48.55,38.9 | 48.55,38.9 R40.2 | C34.1 53.3,46.25 54.1,45.45 54.1,43.3 54.6,42.8 56.73,42.8 IC18.7 56.77,42.8 57.95,42.8 58.3,42.45 58.3,39.35 57.9,38.95 C35.1 54.9,38.35 54.7,38.15 50.45,38.15 49.7,38.9 48.55,38.9 | IC13.8 R32.2
  Top 0.4: v63.25,51.4 54.25,51.4 53.3,50.45 C33.1
  Top 0.6: J01.A45 67.86,53.52 67.7,53.35 67.7,53.3 67.4,53 v67.4,51.4
  Bottom 0.2: J06.1 J07.1 | v77.45,21.3 76.6,21.3 v75.95,21.95 | v68.15,22.1 71.55,22.1 71.9,22.45 v71.9,23.1
  Bottom 0.4: v63.25,51.4 v67.4,51.4 80.4,51.4 82.4,49.4 82.55,49.2 82.55,38.55 83.1,38 83.1,32.5 82.85,32.2 82.85,29.48 J07.1
MEM0  (via drill 0.3)
  Top 0.2: R32.1 70.74,18.11 IC11.8 73.37,17.42 73,17.05 72.1,17.05 71.7,16.65 71.7,15.64 IC13.6 v71.75,14.2 | IC14.6 77.24,14.24 v77.2,14.2 | IC12.6 v66.24,14.21 v66.25,14.2 | IC15.6 v60.74,14.21 v60.75,14.2
  Bottom 0.2: v77.2,14.2 v71.75,14.2 v66.25,14.2 v60.75,14.2
MEM1  (via drill 0.3)
  Top 0.2: IC11.9 78.51,17.31 IC14.5 78.51,13.91 v78.1,13.5 | v73.05,13.5 73.05,15.56 IC13.5 | IC12.5 v67.51,13.51 v67.5,13.5 | IC15.5 62.01,13.54 v62.05,13.5 | R33.1 70.85,19.4 71.25,19.4 71.65,19 v71.85,19
  Bottom 0.2: v73.05,13.5 v78.1,13.5 78.1,16.55 77.7,16.85 72.5,16.85 71.85,17.5 v71.85,19 | v73.05,13.5 v67.5,13.5 v62.05,13.5 | v73.05,13.5 73,13.55
MISO  (via drill 0.3)
  Top 0.2: IC1.22 51.5,22.1
  Top 0.25: 51.5,22.1 52.15,22.75 52.15,24.92 J02.2 53.44,25.51 54.1,24.85 54.72,24.25 54.7,23.4 56.5,21.6 57.61,21.6 | IC6.2 59.52,28.43 60.15,27.8 v60.15,26.25 | 57.61,21.6 59.8,21.6 60.15,21.95 v60.15,22.85 | 57.61,21.6 IC5.2
  Bottom 0.25: v60.15,22.85 v60.15,26.25
MISSION_MEM_SW  (via drill 0.3)
  Top 0.2: IC11.1 73.37,24.32 | 73.37,24.32 73.7,24.65 74.75,24.65 R34.1 | 73.37,24.32 73.35,24.34 73.35,25.75 73.65,26.05 R35.2 74.8,26.7 75.4,27.3 v75.4,29.3 | v74.25,50.05 74.25,55.01 J01.A50
  Bottom 0.2: v75.4,29.3 77.8,31.85 77.8,35.25 80.35,37.9 80.35,48.2 79.25,49.35 74.95,49.35 v74.25,50.05
MISSION_RST  (via drill 0.3)
  Top 0.25: v50.9,30.4 C07.1
  Bottom 0.25: J03.1 36.7,5.55 41.8,10.65 41.8,13.2 48.35,19.75 48.35,24.25 51.1,27 51.1,27.75 50.75,28.15 50.75,28.8 51.15,29.25 51.15,30.15 v50.9,30.4
MOSI  (via drill 0.3)
  Top 0.2: IC1.21 51.67,21.6
  Top 0.25: 51.67,21.6 53,22.95 53.44,23.39 J02.3 53.47,23.58 54.65,22.4 54.65,18.8 55.1,18.35 59.65,18.35 61.1,19.85 | IC6.5 61.65,25.89 v61.1,25.35 | 61.1,19.85 61.9,19.05 IC5.5 | 61.1,19.85 v61.1,20
  Bottom 0.25: v61.1,20 v61.1,25.35
N$1
  Top 0.2: IC1.100 47.8,8.4 | R02.2 C11.1
  Top 0.25: 47.8,8.4 48.25,8 R02.2
N$2  (via drill 0.3)
  Top 0.2: R34.2 76.1,24.65 76.8,23.95 v76.8,23.7
  Bottom 0.2: v76.8,23.7 79.25,23.7 79.85,24.3 79.85,25.48 J06.2
N$3
  Top 0.2: IC1.34 43.8,27.75
  Top 0.25: 43.8,27.75 43.4,28.15 42.4,28.15 42.2,28.35 Q401.2 42.25,29.8 C05.2
N$4
  Top 0.25: IC4.4 21.05,8.25 20.45,8.85 20.45,20.35 20.05,20.75 17.51,20.75 IC3.5
N$5  (via drill 0.3)
  Top 0.25: R13.2 R14.2 13.6,7.95 13.2,8.35 v12.4,8.35 V2.3 | v7.95,14 V3.3
  Bottom 0.25: v12.4,8.35 10.45,8.35 9.85,8.95 9.85,12.75 8.6,14 v7.95,14
N$6
  Top 0.25: IC18.2 53.52,42.78 | 53.52,42.78 54.8,41.5 56.73,41.5 IC18.6 | IC17.5 53.01,45.74 53.5,45.25 53.5,42.8 53.52,42.78
N$7
  Top 0.25: IC2.10 22.9,43.2 22.4,43.7 R18.1
N$8
  Top 0.25: R20.2 R19.1 29.85,47.1 IC2.2
N$9  (via drill 0.3)
  Top 0.2: R23.2 15.8,38.05 15.45,38.4 | 15.45,38.4 15.45,39.04 IC7.1 | R24.1 10.6,41.05 11.2,41.65 11.2,43.5 10.7,44 9.05,44 6.65,41.65 6.65,38.9 7.25,38.3 v11.25,38.3 | 15.45,38.4 15.35,38.3 v14.05,38.3
  Bottom 0.2: v11.25,38.3 v14.05,38.3
N$10  (via drill 0.3)
  Top 0.25: v47.35,39.15 R36.1
  Bottom 0.25: v47.35,39.15 44.9,39.15 44.45,39.6 44.45,40.7 IC16.2
N$11
  Top 0.25: R39.1 49.4,49.95 49.8,49.55 IC17.8
N$12  (via drill 0.3)
  Top 0.254: D1.A v52.8,7.75 | v55.75,13.35 R10.1
  Bottom 0.254: v52.8,7.75 55.65,10.6 55.65,13.25 v55.75,13.35
N$13
  Top 0.2: R26.2 7.45,41.7 8.05,42.3 C25.2
N$14
  Top 0.25: R39.2 48.1,49.9 47.75,49.55 IC17.1
N$15
  Top 0.25: R40.1 R41.2 51.55,41.5 IC18.3
N$16
  Top 0.25: IC17.3 47.73,47.02 48,46.75 48,43.2 47.35,42.55 R36.2
N$17
  Top 0.25: R411.2 IC2.11
N$18  (via drill 0.3)
  Top 0.254: v55.75,14.6 R11.1 | D2.A v54.75,7.7
  Bottom 0.254: v55.75,14.6 55.9,14.6 56.55,13.95 56.55,9.5 v54.75,7.7
N$19
  Top 0.2: R25.1 9.05,40.85 9.2,40.7 9.5,40.45 R24.2 10.82,40.38 IC7.6
N$20
  Top 0.2: IC7.2 17.18,39.73 R23.1 17.55,40.5 18.8,41.75 R22.2 R21.2
N$21  (via drill 0.3)
  Top 0.2: IC11.12 80.32,20.03 80.4,19.95 81.8,19.95 v82.75,20.9 | R29.1 v71.7,24.6 71.7,25.3 71.45,25.55 70.5,25.55 68.82,27.23 IC10.5
  Bottom 0.2: v82.75,20.9 81.95,21.85 79.6,21.85 78.4,20.55 76.35,20.55 75.55,21.35 73.35,21.35 73.05,21.75 73.05,23.5 73.25,23.7 73.25,24.65 73.05,24.85 72.05,24.85 71.8,24.6 v71.7,24.6
N$22
  Top 0.25: IC17.2 44.44,48.28 R38.2 42.8,47.9 R37.2
N$23
  Top 0.406: R12.2 D401.A
N$24
  Top 0.2: R42.2 81.75,34.65 81.5,34.4 80.42,34.4 IC8.7
N$25
  Top 0.2: R26.1 R25.2 8.8,39.25 9,39.05 10.8,39.05 10.9,39.15 10.9,39.55 11.05,39.7 11.66,39.7 IC7.7
N$26
  Top 0.2: C23.2 R21.1
N$27  (via drill 0.3)
  Top 0.2: C24.2 v18.8,40.5 | v17.55,41.4 17.55,42.35 R22.1
  Bottom 0.2: v18.8,40.5 18.45,40.5 v17.55,41.4
N$28  (via drill 0.3)
  Top 0.2: IC2.29 R17.2 33.6,41.05 34.5,40.15 v34.85,40.15 | v36.7,42.9 36.85,42.75
  Bottom 0.2: v36.7,42.9 35.8,42.9 35.45,42.55 35.45,40.75 v34.85,40.15
N$29
  Top 0.2: R44.1 80.47,37.9 IC9.7
N$32  (via drill 1 pad 1.8)
  other vias: 15.34,81.28
N$33
  Top 0.2: C26.1 R27.1 71.97,28.62 IC10.8 IC10.7
N$34  (via drill 1 pad 1.8)
  other vias: 15.34,78.74
N$35  (via drill 1 pad 1.8)
  other vias: 15.34,76.2
N$36  (via drill 1 pad 1.8)
  other vias: 15.34,73.66
N$37  (via drill 1 pad 1.8)
  other vias: 15.34,71.12
N$38  (via drill 1 pad 1.8)
  other vias: 15.34,68.58
N$39  (via drill 1 pad 1.8)
  other vias: 15.34,66.04
N$40  (via drill 1 pad 1.8)
  other vias: 15.34,63.5
N$41  (via drill 1 pad 1.8)
  other vias: 15.34,60.96
N$42  (via drill 1 pad 1.8)
  other vias: 17.88,60.96
N$43  (via drill 1 pad 1.8)
  other vias: 17.88,63.5
N$44  (via drill 1 pad 1.8)
  other vias: 17.88,66.04
N$45  (via drill 1 pad 1.8)
  other vias: 17.88,68.58
N$46  (via drill 1 pad 1.8)
  other vias: 17.88,71.12
N$47  (via drill 1 pad 1.8)
  other vias: 17.88,73.66
N$48  (via drill 1 pad 1.8)
  other vias: 17.88,76.2
N$49  (via drill 1 pad 1.8)
  other vias: 17.88,78.74
N$50  (via drill 1 pad 1.8)
  other vias: 17.88,81.28
N$51  (via drill 1 pad 1.8)
  other vias: 20.42,81.28
N$52  (via drill 1 pad 1.8)
  other vias: 20.42,78.74
N$53  (via drill 1 pad 1.8)
  other vias: 20.42,76.2
N$54  (via drill 1 pad 1.8)
  other vias: 20.42,73.66
N$55  (via drill 1 pad 1.8)
  other vias: 20.42,71.12
N$56  (via drill 1 pad 1.8)
  other vias: 20.42,68.58
N$57  (via drill 1 pad 1.8)
  other vias: 20.42,66.04
N$58  (via drill 1 pad 1.8)
  other vias: 20.42,63.5
N$59  (via drill 1 pad 1.8)
  other vias: 20.42,60.96
N$60  (via drill 1 pad 1.8)
  other vias: 22.96,60.96
N$61  (via drill 1 pad 1.8)
  other vias: 22.96,63.5
N$62  (via drill 1 pad 1.8)
  other vias: 22.96,66.04
N$63  (via drill 1 pad 1.8)
  other vias: 22.96,68.58
N$64  (via drill 1 pad 1.8)
  other vias: 22.96,71.12
N$65  (via drill 1 pad 1.8)
  other vias: 22.96,73.66
N$66  (via drill 1 pad 1.8)
  other vias: 22.96,76.2
N$67  (via drill 1 pad 1.8)
  other vias: 22.96,78.74
N$68  (via drill 1 pad 1.8)
  other vias: 22.96,81.28
N$69  (via drill 1 pad 1.8)
  other vias: 25.5,81.28
N$70  (via drill 1 pad 1.8)
  other vias: 25.5,78.74
N$71  (via drill 1 pad 1.8)
  other vias: 25.5,76.2
N$72  (via drill 1 pad 1.8)
  other vias: 25.5,73.66
N$73  (via drill 1 pad 1.8)
  other vias: 25.5,68.58
N$74  (via drill 1 pad 1.8)
  other vias: 25.5,71.12
N$75  (via drill 1 pad 1.8)
  other vias: 25.5,66.04
N$76  (via drill 1 pad 1.8)
  other vias: 25.5,63.5
N$77  (via drill 1 pad 1.8)
  other vias: 25.5,60.96
N$78  (via drill 1 pad 1.8)
  other vias: 28.04,60.96
N$79  (via drill 1 pad 1.8)
  other vias: 28.04,66.04
N$80  (via drill 1 pad 1.8)
  other vias: 28.04,63.5
N$81  (via drill 1 pad 1.8)
  other vias: 28.04,68.58
N$82  (via drill 1 pad 1.8)
  other vias: 28.04,71.12
N$83  (via drill 1 pad 1.8)
  other vias: 28.04,73.66
N$84  (via drill 1 pad 1.8)
  other vias: 28.04,76.2
N$85  (via drill 1 pad 1.8)
  other vias: 28.04,78.74
N$86  (via drill 1 pad 1.8)
  other vias: 28.04,81.28
N$87  (via drill 1 pad 1.8)
  other vias: 30.58,81.28
N$88  (via drill 1 pad 1.8)
  other vias: 30.58,78.74
N$89  (via drill 1 pad 1.8)
  other vias: 30.58,76.2
N$90  (via drill 1 pad 1.8)
  other vias: 30.58,73.66
N$91  (via drill 1 pad 1.8)
  other vias: 30.58,71.12
N$92  (via drill 1 pad 1.8)
  other vias: 30.58,68.58
N$93  (via drill 1 pad 1.8)
  other vias: 30.58,66.04
N$94  (via drill 1 pad 1.8)
  other vias: 30.58,63.5
N$95  (via drill 1 pad 1.8)
  other vias: 30.58,60.96
N$96  (via drill 1 pad 1.8)
  other vias: 33.12,60.96
N$97  (via drill 1 pad 1.8)
  other vias: 33.12,63.5
N$98  (via drill 1 pad 1.8)
  other vias: 33.12,66.04
N$99  (via drill 1 pad 1.8)
  other vias: 33.12,68.58
N$100  (via drill 1 pad 1.8)
  other vias: 33.12,71.12
N$101  (via drill 1 pad 1.8)
  other vias: 33.12,73.66
N$102  (via drill 1 pad 1.8)
  other vias: 33.12,76.2
N$103  (via drill 1 pad 1.8)
  other vias: 33.12,78.74
N$104  (via drill 1 pad 1.8)
  other vias: 33.12,81.28
N$105  (via drill 1 pad 1.8)
  other vias: 35.66,81.28
N$106  (via drill 1 pad 1.8)
  other vias: 35.66,78.74
N$107  (via drill 1 pad 1.8)
  other vias: 35.66,73.66
N$108  (via drill 1 pad 1.8)
  other vias: 35.66,76.2
N$109  (via drill 1 pad 1.8)
  other vias: 35.66,71.12
N$110  (via drill 1 pad 1.8)
  other vias: 35.66,68.58
N$111  (via drill 1 pad 1.8)
  other vias: 35.66,66.04
N$112  (via drill 1 pad 1.8)
  other vias: 35.66,63.5
N$113  (via drill 1 pad 1.8)
  other vias: 35.66,60.96
N$114  (via drill 1 pad 1.8)
  other vias: 38.2,60.96
N$115  (via drill 1 pad 1.8)
  other vias: 38.2,63.5
N$116  (via drill 1 pad 1.8)
  other vias: 38.2,66.04
N$117  (via drill 1 pad 1.8)
  other vias: 38.2,68.58
N$118  (via drill 1 pad 1.8)
  other vias: 38.2,71.12
N$119  (via drill 1 pad 1.8)
  other vias: 38.2,73.66
N$120  (via drill 1 pad 1.8)
  other vias: 38.2,76.2
N$121  (via drill 1 pad 1.8)
  other vias: 38.2,78.74
N$122  (via drill 1 pad 1.8)
  other vias: 38.2,81.28
N$123  (via drill 1 pad 1.8)
  other vias: 40.74,81.28
N$124  (via drill 1 pad 1.8)
  other vias: 40.74,78.74
N$125  (via drill 1 pad 1.8)
  other vias: 40.74,76.2
N$126  (via drill 1 pad 1.8)
  other vias: 40.74,73.66
N$127  (via drill 1 pad 1.8)
  other vias: 40.74,71.12
N$128  (via drill 1 pad 1.8)
  other vias: 40.74,68.58
N$129  (via drill 1 pad 1.8)
  other vias: 40.74,63.5
N$130  (via drill 1 pad 1.8)
  other vias: 40.74,66.04
N$131  (via drill 1 pad 1.8)
  other vias: 40.74,60.96
N$132  (via drill 1 pad 1.8)
  other vias: 43.28,60.96
N$133  (via drill 1 pad 1.8)
  other vias: 43.28,63.5
N$134  (via drill 1 pad 1.8)
  other vias: 43.28,66.04
N$135  (via drill 1 pad 1.8)
  other vias: 43.28,68.58
N$136  (via drill 1 pad 1.8)
  other vias: 43.28,71.12
N$137  (via drill 1 pad 1.8)
  other vias: 43.28,73.66
N$138  (via drill 1 pad 1.8)
  other vias: 43.28,76.2
N$139  (via drill 1 pad 1.8)
  other vias: 43.28,78.74
N$140  (via drill 1 pad 1.8)
  other vias: 43.28,81.28
N$141  (via drill 1 pad 1.8)
  other vias: 45.82,60.96
N$142  (via drill 1 pad 1.8)
  other vias: 45.82,63.5
N$143  (via drill 1 pad 1.8)
  other vias: 45.82,66.04
N$144  (via drill 1 pad 1.8)
  other vias: 45.82,68.58
N$145  (via drill 1 pad 1.8)
  other vias: 45.82,71.12
N$146  (via drill 1 pad 1.8)
  other vias: 45.82,73.66
N$147  (via drill 1 pad 1.8)
  other vias: 45.82,76.2
N$148  (via drill 1 pad 1.8)
  other vias: 45.82,78.74
N$149  (via drill 1 pad 1.8)
  other vias: 45.82,81.28
N$150  (via drill 1 pad 1.8)
  other vias: 48.36,81.28
N$151  (via drill 1 pad 1.8)
  other vias: 48.36,78.74
N$152  (via drill 1 pad 1.8)
  other vias: 48.36,76.2
N$153  (via drill 1 pad 1.8)
  other vias: 48.36,73.66
N$154  (via drill 1 pad 1.8)
  other vias: 48.36,71.12
N$155  (via drill 1 pad 1.8)
  other vias: 48.36,68.58
N$156  (via drill 1 pad 1.8)
  other vias: 48.36,66.04
N$157  (via drill 1 pad 1.8)
  other vias: 48.36,63.5
N$158  (via drill 1 pad 1.8)
  other vias: 48.36,60.96
N$159  (via drill 1 pad 1.8)
  other vias: 50.9,60.96
N$160  (via drill 1 pad 1.8)
  other vias: 50.9,63.5
N$161  (via drill 1 pad 1.8)
  other vias: 50.9,66.04
N$162  (via drill 1 pad 1.8)
  other vias: 50.9,68.58
N$163  (via drill 1 pad 1.8)
  other vias: 50.9,71.12
N$164  (via drill 1 pad 1.8)
  other vias: 50.9,73.66
N$165  (via drill 1 pad 1.8)
  other vias: 50.9,76.2
N$166  (via drill 1 pad 1.8)
  other vias: 50.9,78.74
N$167  (via drill 1 pad 1.8)
  other vias: 50.9,81.28
N$168  (via drill 1 pad 1.8)
  other vias: 53.44,60.96
N$169  (via drill 1 pad 1.8)
  other vias: 53.44,63.5
N$170  (via drill 1 pad 1.8)
  other vias: 53.44,66.04
N$171  (via drill 1 pad 1.8)
  other vias: 53.44,68.58
N$172  (via drill 1 pad 1.8)
  other vias: 53.44,71.12
N$173  (via drill 1 pad 1.8)
  other vias: 53.44,73.66
N$174  (via drill 1 pad 1.8)
  other vias: 53.44,76.2
N$175  (via drill 1 pad 1.8)
  other vias: 53.44,78.74
N$176  (via drill 1 pad 1.8)
  other vias: 53.44,81.28
N$177  (via drill 1 pad 1.8)
  other vias: 55.98,81.28
N$178  (via drill 1 pad 1.8)
  other vias: 55.98,78.74
N$179  (via drill 1 pad 1.8)
  other vias: 55.98,76.2
N$180  (via drill 1 pad 1.8)
  other vias: 55.98,73.66
N$181  (via drill 1 pad 1.8)
  other vias: 55.98,71.12
N$182  (via drill 1 pad 1.8)
  other vias: 55.98,68.58
N$183  (via drill 1 pad 1.8)
  other vias: 55.98,66.04
N$184  (via drill 1 pad 1.8)
  other vias: 55.98,63.5
N$185  (via drill 1 pad 1.8)
  other vias: 55.98,60.96
OE  (via drill 0.3)
  Top 0.2: 41.3,20.1 IC1.39
  Top 0.25: 41.3,20.1 40.75,19.55 v40.35,19.55 | v26.65,18.95 26.65,18.6 27.05,18.2 28.58,18.2 IC3.22
  Bottom 0.25: v40.35,19.55 27.25,19.55 v26.65,18.95
OP_BIAS  (via drill 0.3)
  Top 0.2: C36.1 14,35.8 R45.2 R46.1 13.3,38.05 13.3,38.85 13.95,39.5 13.95,40.2 14.1,40.35 15.39,40.35 IC7.3 15.44,40.35 16.4,40.35 v16.6,40.55 | IC7.5 11.68,43.53 v12.15,44
  Bottom 0.2: v12.15,44 13,44 13.2,43.8 13.2,41.25 14.1,40.35 16.4,40.35 v16.6,40.55
PCLK  (via drill 0.3)
  Top 0.25: J05.7 12.85,24.15 13.3,23.7 13.3,21.95 14.4,20.85 14.4,16.1 v14,15.7 | v19.45,15.7 17.49,15.7 IC3.9
  Bottom 0.25: v14,15.7 v19.45,15.7
PWM_OUT  (via drill 0.3)
  Top 0.2: R16.1 18.8,34.7 19.3,34.2 36.1,34.2 38.35,36.45 48,36.45 48.55,35.9 49.1,35.9 49.65,35.35 53.65,35.35 v54.05,35.7 | IC1.7 52.05,14.6 52.9,15.45 55.15,15.45 55.45,15.75 55.45,17.15 55.1,17.5 53.4,17.5 53.35,17.55 v53.2,17.75
  Bottom 0.2: v54.05,35.7 54.5,35.7 54.7,35.4 54.65,19.2 v53.2,17.75
PWM_SIG
  Top 0.2: C24.1 18.75,38 18.8,38 R16.2 C37.1
RCLK  (via drill 0.3)
  Top 0.18: 40.8,20.95 IC1.40
  Top 0.25: 40.8,20.95 40.3,20.45 v39.45,20.45 | v30.4,21.35 30.4,20.4 R15.2 | IC3.20 26.91,15.7 25.25,17.35 25.25,20.7 v26.5,21.95
  Bottom 0.25: v39.45,20.45 31.85,20.45 30.95,21.35 v30.4,21.35 29.8,21.95 v26.5,21.95
RRST  (via drill 0.3)
  Top 0.2: 41.8,19.2 IC1.38
  Top 0.25: IC3.21 26.71,16.96 26.7,16.95 26.2,17.45 v26.2,17.75 | v40.35,17.75 41.8,19.2
  Bottom 0.25: v26.2,17.75 v40.35,17.75
RST  (via drill 0.3)
  Top 0.2: IC1.30 45.8,26.75 | C07.2 49.75,28.52 49.7,28.46
  Top 0.25: R01.1 48.5,28.8 48.52,28.48 | 45.8,26.75 46.1,27.05 47.15,27.05 48.12,28.02 48.52,28.48 | 48.52,28.48 49.7,28.46 v51.45,28.45
  Bottom 0.25: J02.1 53.34,28.46 v51.45,28.45
RX  (via drill 0.3)
  Top 0.2: R44.2 83.5,50.55 84.85,51.9 84.85,60.35 84.5,60.7 74.25,60.7 72.95,59.4 J01.B49 | J09.1 82.6,65.4 82.6,62.8 81.3,61.5 72.1,61.5 70.65,60.05 v70.1,60.05
  Bottom 0.2: v70.1,60.05 72.35,60.05 72.95,59.4 J01.B49
RX0
  Top 0.2: IC1.2 51.55,12.1
  Top 0.25: 51.55,12.1 52.75,10.9 R06.2
RX1  (via drill 0.3)
  Top 0.2: IC8.2 69.92,34.38 68.95,35.35 63.6,35.35 v63.3,35.7 | v61.5,33.8 60.95,33.25 59.8,33.25 59.3,33.75 49,33.75 48.4,34.3 47.9,34.3 47.35,34.85 39.65,34.85 39,34.15 v39,31.6 | v38.05,27.5 38.3,27.2 IC1.45
  Bottom 0.2: v63.3,35.7 63.3,35.65 v61.5,33.8 | v39,31.6 39,28.4 v38.05,27.5
RX2  (via drill 0.3)
  Top 0.2: IC1.12 51.2,17.1 51.85,17.75 v52.1,17.75 | v42.4,7.75 41.3,6.65 31.35,6.65 28.55,3.85 10.75,3.85 7.45,7.05 7.45,10.75 4.65,13.55 v4.65,14.95 | v4.6,47.55 8.85,51.8 8.85,60.35 11.35,62.85 11.35,64.69 J12.1
  Bottom 0.2: v52.1,17.75 51.15,17.75 50.75,18.15 47.95,18.15 45.55,15.75 42.7,12.85 42.65,8 v42.4,7.75 | v4.65,14.95 4.65,15.1 4.7,15.6 5.1,16.05 5.1,37.4 4.6,37.9 v4.6,47.55
SCCB_CLK  (via drill 0.3)
  Top 0.18: 40.3,21.45 IC1.41
  Top 0.25: J05.3 9.15,22.15 v8.95,21.95 | v39.95,21.25 40.1,21.25 40.3,21.45
  Bottom 0.25: v8.95,21.95 25.5,21.95 26.3,22.75 30.3,22.75 32.1,20.95 38.85,20.95 39.15,21.25 v39.95,21.25
SCCB_DATA  (via drill 0.3)
  Top 0.18: 39.8,22.65 IC1.42
  Top 0.25: v8.3,22.65 J05.4 | v39.25,22.1 39.8,22.65
  Bottom 0.25: v8.3,22.65 25.3,22.65 26.1,23.45 30.35,23.45 32.35,21.45 38.6,21.45 v39.25,22.1
SCK  (via drill 0.3)
  Top 0.2: IC1.20 53.4,21.1
  Top 0.25: 53.4,21.1 53.46,21.04 J02.4 53.46,20.89 53.45,20.2 53.45,18.9 54.45,17.9 64.64,17.89 65.2,18.4 65.2,20.05 64.95,20.3 63.79,20.3 IC5.6 61.87,20.32 v61.85,20.3 | v61.85,27.15 63.76,27.15 IC6.6
  Bottom 0.25: v61.85,20.3 v61.85,27.15
SCL_M  (via drill 0.3)
  Top 0.2: IC1.43 39.3,27.87 36.72,30.45 36.72,30.48 35.95,31.25 | 34.95,32.25 35.95,31.25 | 34.95,32.25 13.95,32.25 13.75,32.45 12.95,32.45 12.75,32.25 v11.75,32.25 | IC10.3 69.47,34.23 68.75,34.95 49.55,34.95 48.95,35.5 48.4,35.5 47.85,36.05 38.75,36.05 36.55,33.8 34.95,32.25 | IC2.28 33.05,40.8 33.85,40 v33.85,37.45 | v35.6,29.95 R03.1 | 35.95,31.25 v36.9,31.25
  Bottom 0.2: v33.85,37.45 33.85,34.65 35.55,32.9 36.25,32.9 36.9,32.3 v36.9,31.25 v35.6,29.95 | J11.1 12.42,71.12 10.95,69.65 10.95,58.9 9.85,57.8 9.85,51.05 8.2,49.4 8.2,36.9 10.35,34.65 10.35,34.25 11.75,32.85 v11.75,32.25
SDA_M  (via drill 0.3)
  Top 0.2: IC1.44 38.8,27.7 37.1,29.4 | 32.85,31.8 32.85,31.78 | IC10.4 68.82,34.23 68.5,34.55 49.35,34.55 48.75,35.1 48.25,35.1 47.7,35.65 39.35,35.65 v36,32.25 | IC2.27 32.95,40 33.3,39.65 33.3,37.9 v32.85,37.45 | 34.9,31.6 37.1,29.4 | 34.9,31.6 34.7,31.8 32.85,31.8 | R04.1 36.4,28.7 37.1,29.4 | v34.7,30.95 34.7,31.4 34.9,31.6 | v13.4,31.8 32.85,31.8
  Bottom 0.2: v36,32.25 v34.7,30.95 32.85,32.8 v32.85,37.45 | J11.2 12.53,68.58 11.35,67.4 11.35,58.75 10.25,57.65 10.25,50.85 8.6,49.2 8.6,37.05 10.8,34.75 10.8,34.4 v13.4,31.8
TEMP_MISSION  (via drill 0.3)
  Top 0.25: J01.B7 19.61,57.74 19.6,57.8 18.75,58.55 10.55,58.55 9.7,57.7 v9.7,49.2 | v48.7,48.3 48.7,47.85 49.55,47 51.23,47 IC17.6
  Bottom 0.25: v9.7,49.2 48.35,49.2 48.7,48.9 v48.7,48.3
TX
  Top 0.2: R42.1 84.2,34.65 84.5,34.95 84.5,38.8 84.1,39.2 84.1,50.55 85.25,51.7 85.25,60.5 84.65,61.1 | 84.65,61.1 72.25,61.1 70.4,59.25 J01.B47 | J09.2 83.6,68 84.5,67.1 84.5,61.25 84.65,61.1
TX0
  Top 0.2: IC1.3 52.1,12.6
  Top 0.25: R05.2 52.55,12.15 52.1,12.6
TX1  (via drill 0.3)
  Top 0.2: IC9.2 73.47,37.92 71.35,35.8 64.45,35.8 63.75,36.5 62.7,36.5 v61.95,35.75 | v60.1,33.9 59.85,34.15 49.2,34.15 48.6,34.7 48.1,34.7 47.55,35.25 39.5,35.25 38.35,34.05 38,33.7 v38,31.6 | v37.05,27.5 37.8,26.75 IC1.46
  Bottom 0.2: v60.1,33.9 v61.95,35.75 | v38,31.6 37.95,28.4 v37.05,27.5
TX2  (via drill 0.3)
  Top 0.2: IC1.13 50.9,17.6 50.9,17.85 v51.65,18.6 | v40.85,7.85 40.05,7.05 31.2,7.05 28.4,4.25 10.85,4.25 9.7,5.4 8.75,6.3 7.85,7.2 7.85,11.5 5.5,13.8 v5.5,13.7 | v5.5,46.95 5.5,47.85 9.25,51.6 9.25,60.15 J12.2
  Bottom 0.2: v51.65,18.6 47.8,18.6 47.2,18 45.3,16.05 42.25,13 42.25,9.25 v40.85,7.85 | v5.5,13.7 v5.5,46.95
VDD5  (via drill 0.3, 0.6)
  Top 0.2: v74.55,28 73.95,28 73.4,27.45 R27.2 70.8,27.45 v70.65,27.3 | IC9.8 79.52,38.58 79.2,38.55 79.2,35.05 80.38,35.05 IC8.8
  Top 0.25: C14.1 9.7,7.05 | 9.7,7.05 V2.1 | 9.7,7.05 8.6,7.05 8.25,7.4 8.25,11.75 6.7,13.25 6.7,13.6 5.75,14.55 5.75,16.3 5.95,16.5 C16.1 7.05,16.5 7.35,16.8 V3.1 | 79.2,38.55 79.2,39.25 v78.7,39.75
  Top 0.4: v10.95,5.8 10.3,5.8 9.85,6.25 C14.1
  Top 0.6: C02.1 65.65,40.95 V1.1 66.65,39.43 J04.1 | J01.A43 65.32,48.12 v64.3,47.1
  Bottom 0.2: v74.55,28 78.8,28 78.9,28.1 J07.2
  Bottom 0.25: v70.65,27.3 66.3,27.3 65.8,27.8 | v78.7,39.75 69.03,39.75 J04.1
  Bottom 0.4: J04.1 65.8,36.52 65.8,27.8 65.8,17.7 65.15,17.05 59.75,17.05 58.55,15.9 58.5,5.15 57.6,4.25 45.55,4.2 44.4,5.5 J03.4 42.97,4.15 15.15,4.15 13.9,5.8 v10.95,5.8
  Bottom 0.6: v64.3,47.1 64.3,41.78 J04.1
VDD28
  Top 0.25: J05.1 11.3,20.75 11.7,20.35 11.7,17.6 11.9,17.4 C17.1 | IC4.5 18.65,5.65 13.95,10.35 13.95,13.6 12.8,14.75 12.8,16.45 12.6,16.65 C17.1 | V3.5 11.75,16.8 C17.1
VDD33  (via drill 0.3, 0.6)  (1 unrouted)
  Top 0.2: 45.3,27.15 IC1.31 45.3,18.45 | 47.75,16.1 IC1.10 51.15,16.1 51.4,15.85 54.6,15.85 54.7,15.95 C10.1 | 37.8,11.5 IC1.80 37.8,8.2 C09.1 | IC1.61 v36.45,18.6 36.45,23 33.3,26.2 R04.2 R03.2 | 65.35,29.45 65.2,29.6 64.05,29.6 64.05,28.71 IC6.7 | 65.35,29.45 65.35,23.05 65.15,22.85 IC5.8 | 59.41,27.16 IC6.3 56.79,27.16 C12.1 | 12.9,39.1 13.45,39.65 13.45,40.6 14.15,41.3 C22.1 14.15,43 v14.45,43.3 | 12.9,39.1 11.71,39.1 IC7.8 | 74.65,39.05 75.12,38.58 IC9.1 78.17,38.58 78.5,38.25 78.5,35.2 | 78.5,35.2 78.35,35.05 77.02,35.05 IC8.1 | 78.5,35.2 78.5,34.8 v78.7,34.6 | v80.7,35.8 80.7,36.38 IC9.5 | IC10.2 70.12,31.73 69.25,30.85 66.75,30.85 65.35,29.45 | C08.1 47.4,34 v47.75,33.6 | IC5.3 56.54,20.32 56.45,20.35 C13.1 | 12.59,81.28 J10.1 | R46.2 12.85,39.05 12.9,39.1
  Top 0.25: 45.3,27.15 45.75,27.6 46.95,27.6 47.6,28.25 47.6,30.25 47.75,30.4 R01.2 | 37.8,11.5 39.1,12.8 39.1,18.1 38.6,18.6 v36.45,18.6 | v44.45,18.6 45.15,18.6 45.3,18.45 45.3,17.45 46.65,16.1 47.75,16.1 48.1,15.75 48.1,11.3 49.4,10.15 R02.1 | IC5.3 60.07,20.32 61.35,21.6 63.76,21.6 IC5.7 IC5.8 | IC5.8 64.2,22.86 64.25,22.9 | 64.05,29.6 63.95,29.7 IC6.8 63.8,29.73 | R08.2 63.4,24.35 63.8,23.95 63.8,22.88 IC5.8 | v59.45,27.2 59.41,27.16 | v60.65,28.45 63.76,28.45 IC6.7 | 28.4,45.69 IC2.4 28.3,45.54 28.3,46.45 28.45,46.6 R19.2 26.8,47.2 26.65,47.05 IC2.6 26.65,43.7 | 26.65,43.7 26.65,39.2 25.85,38.4 IC2.18 25.85,35.45 C20.1 v25.05,35.45 | R17.1 34.9,42.6 v34.6,42.9 | v25.45,43.3 26.25,43.3 26.65,43.7 | 74.65,39.05 74.65,40.75 C04.1 | 65.35,29.45 64,29.45 63.8,29.65 63.8,30.75 63.3,31.25 R09.2 | R03.2 v33.3,31.1 | 12.59,81.28 11.35,79.99 11.35,65.45 10.95,65.05 8.15,62.3 2.85,62.3 1.65,61.1 1.65,48.35 3.8,46.2 10.25,46.2 v15,50.95 | 63.8,30.8 63.85,30.8 v64.3,31.25
  Top 0.4: R01.2 48.5,32.85 v47.75,33.6 | v64.25,38.15 65.05,38.15 66.8,36.4 71.15,36.4 74.55,39.8 C04.1
  Top 0.6: R12.1 74.8,40.6 C04.1 74.5,40.8 73.05,40.8 72.95,40.9 | 72.95,40.9 C03.1 | V1.3 72.9,40.95 72.95,40.9
  Bottom 0.2: v25.45,43.3 v14.45,43.3 | v78.7,34.6 79.5,34.6 v80.7,35.8
  Bottom 0.25: v36.45,18.6 v44.45,18.6 | v59.45,27.2 59.45,27.25 v60.65,28.45 | v34.6,42.9 25.85,42.9 v25.45,43.3 | v25.05,35.45 25.05,33.95 25.55,33.45 31.2,33.45 33.3,31.35 v33.3,31.1 | v15,50.95 60.25,50.95 61.2,50 61.2,40.7 63.75,38.15 | v64.3,31.25 64.3,38.1 v64.25,38.15
  Bottom 0.4: v47.75,33.6 47.05,34.35 47.05,37.25 47.85,38.05 50.5,38.05 50.6,38.15 63.75,38.15 v64.25,38.15
VDD33_2  (via drill 0.3)
  Top 0.2: C18.1 15.55,5.75 v15.55,6.9
  Top 0.25: IC3.10 17.48,14.43 v19.5,14.45 | IC3.19 28.64,14.45 v30.1,14.45 30.2,14.55 C19.1 | v15.55,6.9 15.55,8.05 13.5,10.1 13.5,12.8 13.15,13.15 10.15,13.15 9.65,12.65 C15.1 9.55,12.15 V2.5
  Bottom 0.25: v30.1,14.45 v19.5,14.45 19.5,11.45 15.55,7.45 v15.55,6.9
VSYNC  (via drill 0.3)
  Top 0.2: 43.3,23.2 IC1.35
  Top 0.25: J05.5 9.2,23.15 v9,23.4 | v43.6,22.85 43.3,23.2 | IC3.8 19.21,16.96 v19.7,17.45
  Bottom 0.25: v9,23.4 9.05,23.4 | v9,23.4 25.05,23.4 25.85,24.15 30.4,24.15 32.6,21.95 38,21.95 39.1,23.05 43.45,23.05 v43.6,22.85 | v19.7,17.45 19.7,18.1 19.3,18.5 12.35,18.5 10.45,20.4 7.8,20.4 7.25,20.95 7.25,22.95 7.7,23.4 v9,23.4
WEN  (via drill 0.3)
  Top 0.2: 42.3,18.55 IC1.37
  Top 0.25: IC4.1 27.45,5.65 31.95,10.15 v32,10.15 | v39.95,16.2 42.3,18.55
  Bottom 0.25: v32,10.15 33.95,10.15 35.1,11.3 35.1,13.8 37.5,16.2 v39.95,16.2

## Text on the board
tPlace: ARTSAT | D5 | D2 | MORIKAWA FM | ARTSAT Project 2013
tNames: 3V3 | D23 | D24 | D25 | SCL | GND | SDA | RX0 | RX2 | TX0 | TX2 | GND | TTL | 5V | 3.3V | ATP3011F4 | Rev:C | Q401 | +
tDocu: rev:B | C27